# Altium project Constant Current Load.PrjPcb
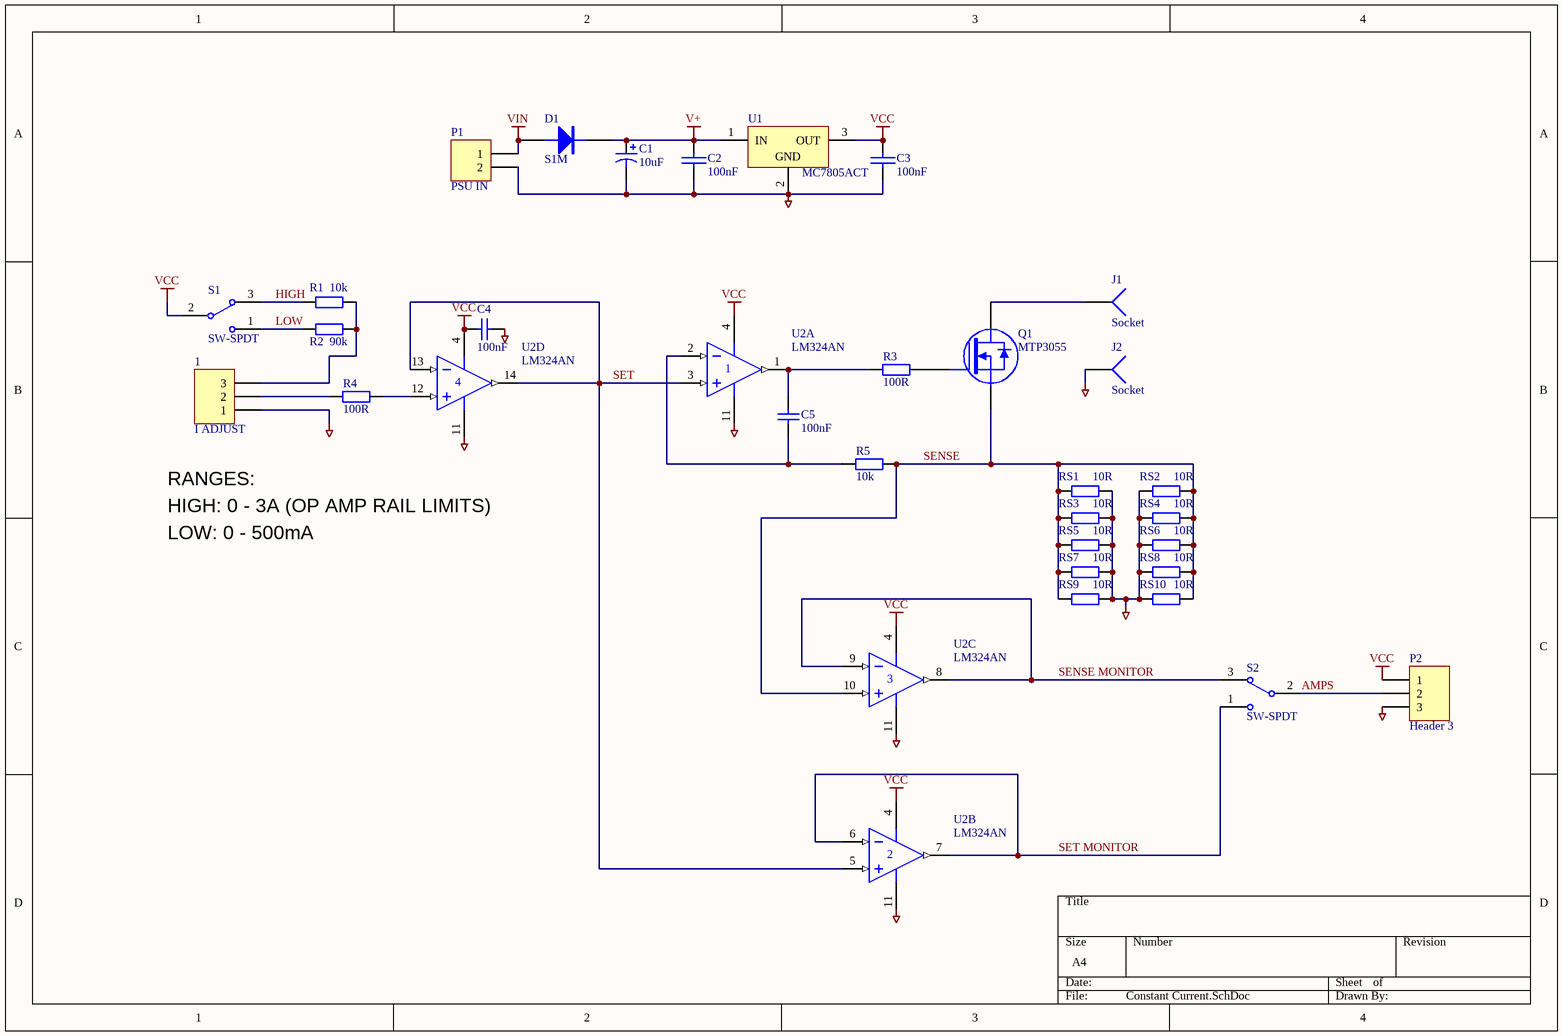
[diagram p0: Constant Current.SchDoc]
1 sheet, 31 parts. Net scope: global (net labels, ports and power ports of the same name join across sheets).
Board files: DISPLAY PANEL V2.PcbDoc, Constant Current Load V200.PcbDoc

## Sheet Constant Current.SchDoc
size A4

### Parts
1  I ADJUST  [PCB POT 17MM]
C1  10uF  [CAP E CASE]
C2  100nF  [CAP 0805]
C3  100nF  [CAP 0805]
C4  100nF  [CAP 0805]
C5  100nF  [CAP 0805]
D1  S1M  [DO-214AC]
J1  Socket  [TP]
J2  Socket  [TP]
P1  PSU IN  [5.08mm HEADER 2 Way RA- With Socket]
P2  Header 3  [HDR1X3]
Q1  MTP3055  [TO-220AB]
R1  value 10k  [RES 0805]  (hidden comment: 0805)
R2  value 90k  [RES 0805]  (hidden comment: 0805)
R3  value 100R  [RES 0805]  (hidden comment: 0805)
R4  value 100R  [RES 0805]  (hidden comment: 0805)
R5  value 10k  [RES 0805]  (hidden comment: 0805)
RS1  value 10R  [RES 1210]  (hidden comment: 0805)
RS2  value 10R  [RES 1210]  (hidden comment: 0805)
RS3  value 10R  [RES 1210]  (hidden comment: 0805)
RS4  value 10R  [RES 1210]  (hidden comment: 0805)
RS5  value 10R  [RES 1210]  (hidden comment: 0805)
RS6  value 10R  [RES 1210]  (hidden comment: 0805)
RS7  value 10R  [RES 1210]  (hidden comment: 0805)
RS8  value 10R  [RES 1210]  (hidden comment: 0805)
RS9  value 10R  [RES 1210]  (hidden comment: 0805)
RS10  value 10R  [RES 1210]  (hidden comment: 0805)
S1  SW-SPDT  [SPDT MINI TOGGLE (BOARD MOUNT)]
S2  SW-SPDT  [SPDT MINI TOGGLE (BOARD MOUNT)]
U1  MC7805ACT  [SOT89]
U2  LM324AN  [SOIC-14]  (parts A,B,C,D of 4)

### Nets
GND: 1.1 C1.2 C2.2 C3.2 C4.1 J2.1 P1.2 P2.3 RS1.1 RS2.2 RS3.1 RS4.2 RS5.1 RS6.2 RS7.1 RS8.2 RS9.1 RS10.2 U1.2(GND) U2.11(V-)
V+: C1.1 C2.1 D1.2(K) U1.1(IN)
VCC: C3.1 C4.2 P2.1 S1.2 U1.3(OUT) U2.4(V+)
VIN: D1.1(A) P1.1
AMPS: P2.2 S2.2
HIGH: R1.1 S1.3
LOW: R2.1 S1.1
SENSE: Q1.3(S) R5.2 RS1.2 RS2.1 RS3.2 RS4.1 RS5.2 RS6.1 RS7.2 RS8.1 RS9.2 RS10.1 U2.10(IN+)
SENSE MONITOR: S2.3 U2.8(OUT) U2.9(IN-)
SET: U2.3(IN+) U2.5(IN+) U2.13(IN-) U2.14(OUT)
SET MONITOR: S2.1 U2.6(IN-) U2.7(OUT)
Net1_2: 1.2 R4.1
Net1_3: 1.3 R1.2 R2.2
NetC5_1: C5.1 R3.1 U2.1(OUT)
NetC5_2: C5.2 R5.1 U2.2(IN-)
NetJ1_1: J1.1 Q1.2(D)
NetQ1_1: Q1.1(G) R3.2
NetR4_2: R4.2 U2.12(IN+)

### Notes on the sheet
- RANGES:
- HIGH: 0 - 3A (OP AMP RAIL LIMITS)
- LOW: 0 - 500mA

### Library data of the parts
1 P2 = Header 3: Header, 3-Pin; LatestRevisionDate: 17-Jul-2002; LatestRevisionNote: Re-released for DXP Platform.; Publisher: Altium Limited
C1 = Cap Pol1: Polarized Capacitor (Radial); Value: 10uF
C2 C3 = CAP: CAPACITOR SMD 0603; Manufacturer: Murata; Manufacturer Part No.: GCM188R71C104KA37D; value: 100nF; Mouser Part no.: 81-GCM188R71C104KA7D; Web link: http://au.mouser.com/ProductDetail/Murata/GCM188R71C104KA37D/?qs=aEuGZpxfbxWKAxwYn%252beTMg%3d%3d
C4 C5 = Cap: Capacitor; Manufacturer: YAEGO; Manufacturer Part No.: CC0603ZRY5V9BB104; Value: 100nF; Mouser Part no.: 603-C0603ZRY5V9BB104; Web link: http://au.mouser.com/ProductDetail/Yageo/CC0603ZRY5V9BB104/?qs=AgBp2OyFlx%252bk1xe0tOfw5lSGBXIDidlPHbEeepmuVSw%3d; Supplier 1: Mouser; Supplier 2: Digi-Key; Supplier Part Number 1: 603-C0603ZRY5V9BB104; Supplier Part Number 2: 311-1343-2-ND
D1 = DIODE: DIODE, POWER; Manufacturer: Taiwan Semiconductor; Mouser Part no.: 821-S1M; Manufacturer Part No.: S1M; value: S1M; Web link: http://au.mouser.com/ProductDetail/Taiwan-Semiconductor/S1M/?qs=sGAEpiMZZMtEwUVCuofpuOlSmRjzJonf%252bmrIm0%252bGbjE%3d
P1 = Header 2: Header, 2-Pin; LatestRevisionDate: 17-Jul-2002; LatestRevisionNote: Re-released for DXP Platform.; Publisher: Altium Limited
Q1 = MOSFET-N4: N-Channel MOSFET
R1-R5 RS1-RS10 = Res2: Resistor
S1 S2 = SW-SPDT: SPDT Subminiature Toggle Switch, Right Angle Mounting, Vertical Actuation; Published: 24-Mar-1999; LatestRevisionDate: 17-Dec-2003; LatestRevisionNote: Schematic revised, PCB Footprint replaced.; DatasheetVersion: 05-Dec-2000; PackageReference: TL36WW15050; Publisher: Altium Limited; PackageDescription: Switch; 4 Leads; ComponentLink1Description: Manufacturer Link; ComponentLink1URL: http://www.apem.com
U1 = MC7805ACT: 3-Terminal Positive Fixed Voltage Regulator; Manufacturer: Fairchild Semiconductor; Value: LM7805ACT; Mouser Part No.: 512-LM7805ACT; Manufacturer Part No.: LM7805ACT; Web link: http://au.mouser.com/ProductDetail/Fairchild-Semiconductor/LM7805ACT/?qs=VOMQJJE%252bBNlQknJDd4ZVLg%3d%3d
U2 = LM324AN: Quadruple Operational Amplifier; Manufacturer: ST MICRO; Value: LM324; Manufacturer Part No.: LM324AN; Mouser Part No.: 511-LM324AN; Web Link: http://au.mouser.com/ProductDetail/STMicroelectronics/LM324AN/?qs=Aez0sHNrW%2fUytSAnJAKyV%252b8BIEGXhIFhom0MkRvP3bs%3d; Supplier 1: Mouser; Supplier Part Number 1: 595-LM324AN; Supplier 2: Digi-Key; Supplier Part Number 2: 497-1579-5-ND
J1 J2 = Socket: LatestRevisionDate: 17-Jul-2002; LatestRevisionNote: Re-released for DXP Platform.; Publisher: Altium Limited